# EAGLE schematic termoresistenza_v1_rev1 (EAGLE 6.5.0)
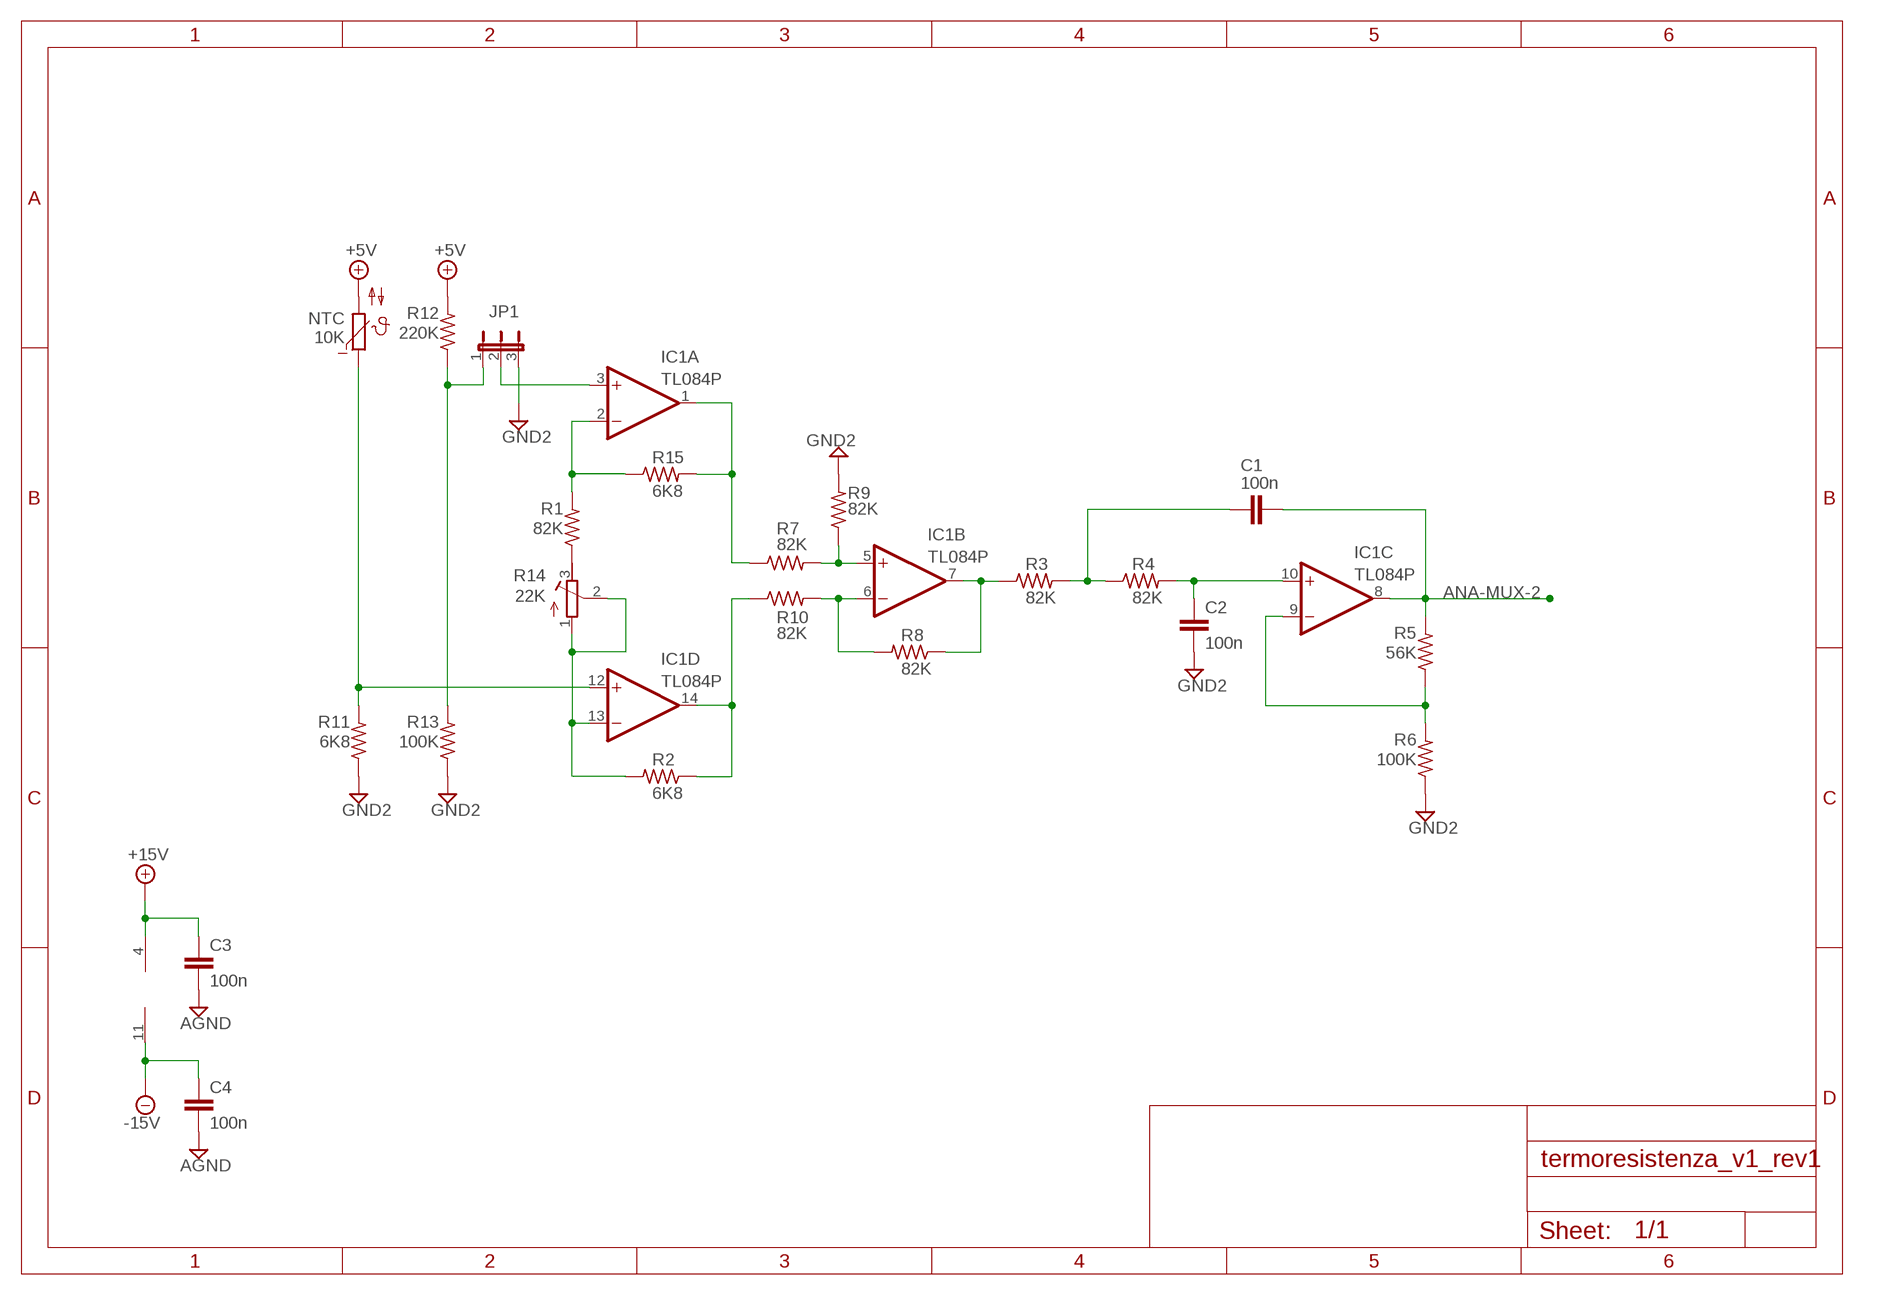
[diagram p0: schematic, sheet 1]

## Parts
C1  100n  C-EU025-025X050  [C025-025X050]
C2  100n  C-EU025-025X050  [C025-025X050]
C3  100n  C-EU025-025X050  [C025-025X050]
C4  100n  C-EU025-025X050  [C025-025X050]
IC1  TL084P  [DIL14]
JP1  JP2E  [JP2]
NTC  10K  NTC640  [P640]
R1  82K  R-US_0204/7  [0204/7]
R2  6K8  R-US_0204/7  [0204/7]
R3  82K  R-US_0204/7  [0204/7]
R4  82K  R-US_0204/7  [0204/7]
R5  56K  R-US_0204/7  [0204/7]
R6  100K  R-US_0204/7  [0204/7]
R7  82K  R-US_0204/7  [0204/7]
R8  82K  R-US_0204/7  [0204/7]
R9  82K  R-US_0204/7  [0204/7]
R10  82K  R-US_0204/7  [0204/7]
R11  6K8  R-US_0204/7  [0204/7]
R12  220K  R-US_0204/7  [0204/7]
R13  100K  R-US_0204/7  [0204/7]
R14  22K  R-TRIMM64W  [RTRIM64W]
R15  6K8  R-US_0204/7  [0204/7]

## Nets
+5V: NTC.2 R12.2
+15V: C3.1 IC1.4(P:V+)
-15V: C4.1 IC1.11(P:V-)
AGND: C3.2 C4.2
ANA-MUX-2: C1.2 IC1.8(C:OUT) R5.2
GND2: C2.2 JP1.3 R6.1 R9.2 R11.1 R13.1
N$1: C2.1 IC1.10(C:+IN) R4.2
N$2: R1.1 R14.3(A)
N$3: IC1.9(C:-IN) R5.1 R6.2
N$4: IC1.2(A:-IN) R1.2 R15.1
N$5: C1.1 R3.2 R4.1
N$6: IC1.1(A:OUT) R10.1 R15.2
N$7: IC1.13(D:-IN) R2.2 R14.1(E) R14.2(S)
N$8: JP1.1 R12.1 R13.2
N$10: IC1.12(D:+IN) NTC.1 R11.2
N$11: IC1.14(D:OUT) R2.1 R7.1
N$12: IC1.6(B:-IN) R7.2 R8.2
N$13: IC1.5(B:+IN) R9.1 R10.2
N$14: IC1.7(B:OUT) R3.1 R8.1
N$15: IC1.3(A:+IN) JP1.2

## Library data of the parts
C1-C4 = rcl:C-EU: CAPACITOR, European symbol
IC1 = linear:TL084: OP AMP
JP1 = jumper:JP2E: JUMPER
NTC = ptc-ntc:NTC640: PHILIPS NTC; OC_FARNELL: unknown; OC_NEWARK: unknown
R1-R13 R15 = resistor:R-US_: RESISTOR, American symbol
R14 = resistor:R-TRIMM: Trimm resistor